# EAGLE design main (EAGLE 6.6.0)
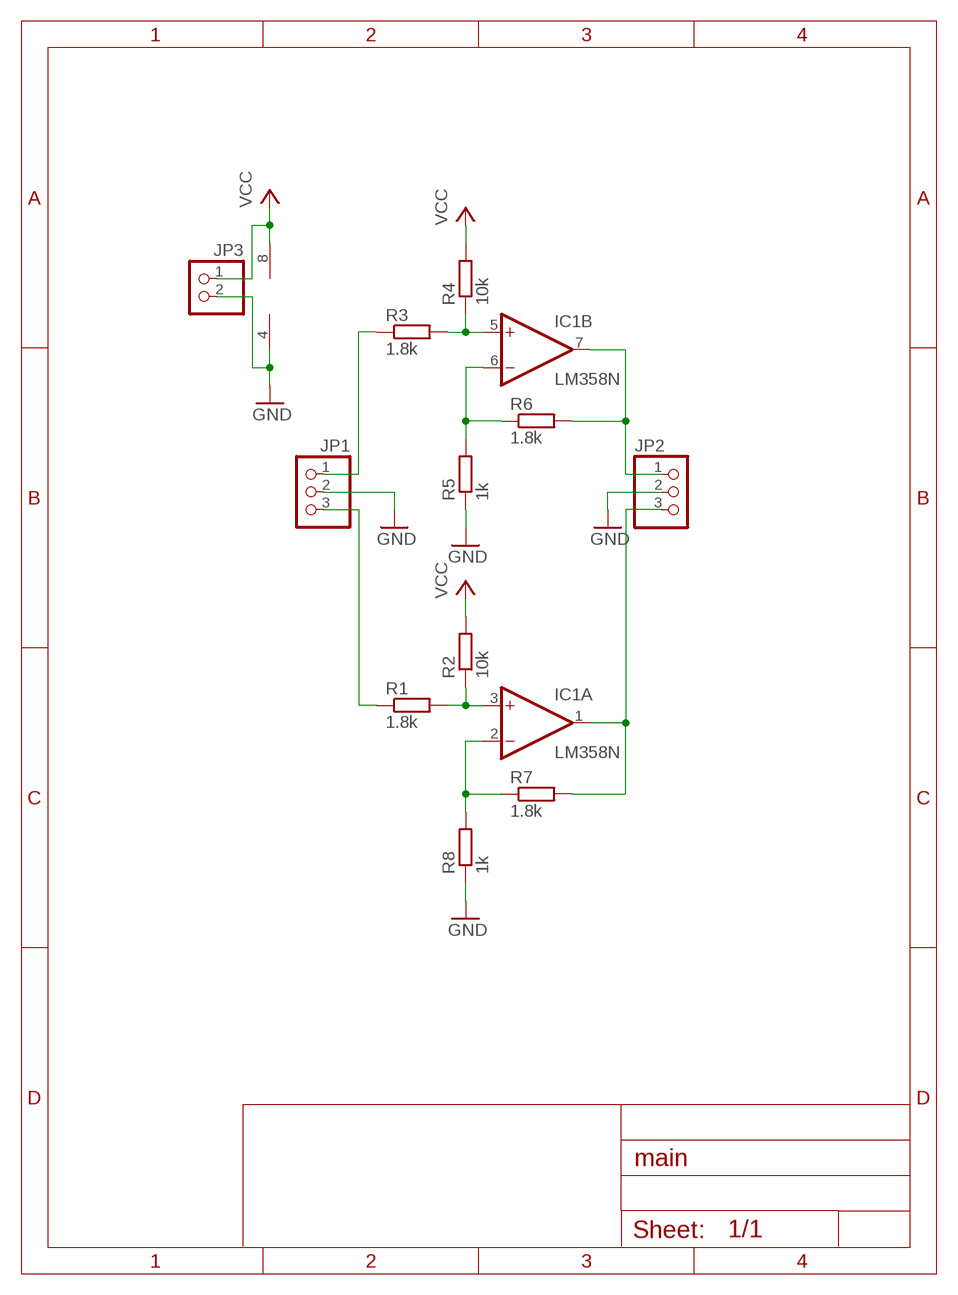
[diagram p0: schematic, sheet 1]

## Parts
IC1  LM358N  [DIL08]
JP1  PINHD-1X3  [1X03]
JP2  PINHD-1X3  [1X03]
JP3  PINHD-1X2  [1X02]
R1  1.8k  R-EU_0204/7  [0204/7]
R2  10k  R-EU_0204/7  [0204/7]
R3  1.8k  R-EU_0204/7  [0204/7]
R4  10k  R-EU_0204/7  [0204/7]
R5  1k  R-EU_0204/7  [0204/7]
R6  1.8k  R-EU_0204/7  [0204/7]
R7  1.8k  R-EU_0204/7  [0204/7]
R8  1k  R-EU_0204/7  [0204/7]

## Nets
GND: IC1.4(P:V-) JP1.2 JP2.2 JP3.2 R5.1 R8.1
N$1: IC1.5(B:+IN) R3.2 R4.1
N$2: IC1.3(A:+IN) R1.2 R2.1
N$3: IC1.6(B:-IN) R5.2 R6.1
N$4: IC1.7(B:OUT) JP2.1 R6.2
N$5: IC1.2(A:-IN) R7.1 R8.2
N$6: IC1.1(A:OUT) JP2.3 R7.2
N$8: JP1.1 R3.1
N$9: JP1.3 R1.1
VCC: IC1.8(P:V+) JP3.1 R2.2 R4.2

## Library data of the parts
IC1 = linear:LM358: OP AMP also LM158; LM258; LM2904 Source: http://cache.national.com/ds/LM/LM158.pdf
JP1 JP2 = pinhead:PINHD-1X3: PIN HEADER
JP3 = pinhead:PINHD-1X2: PIN HEADER
R1-R8 = rcl:R-EU_: RESISTOR, European symbol

## Board
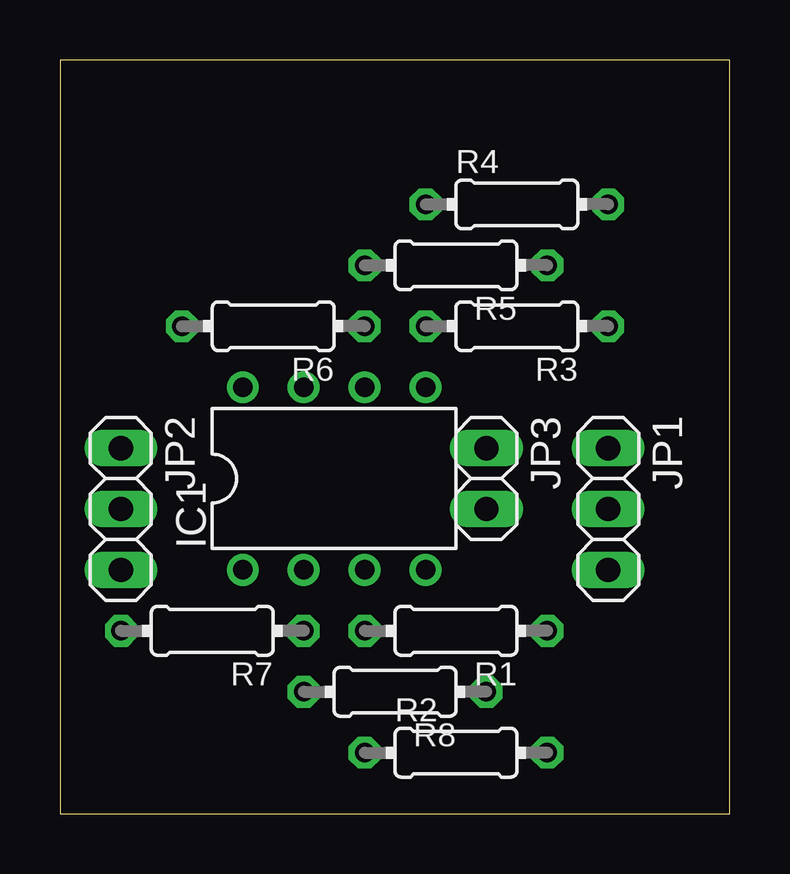
[diagram p1: board, top side]
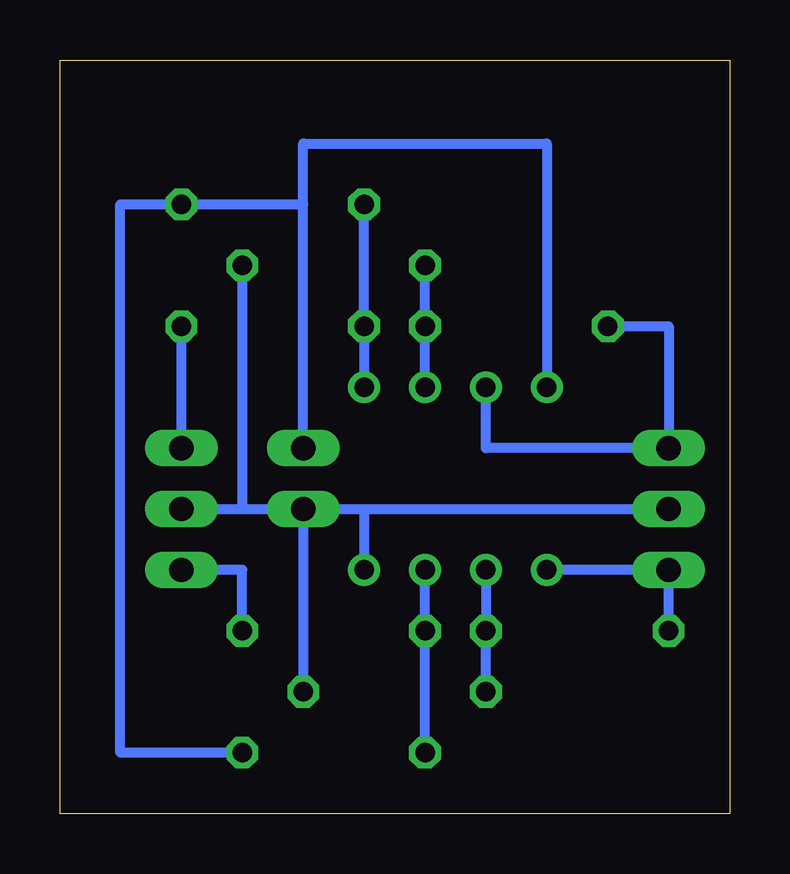
[diagram p2: board, bottom side, seen from below]

Size 27.92 x 31.42 mm. Coordinates in mm from the lower left corner, seen from the top.
Outline: 0,0 27.92,0 27.92,31.42 0,31.42 0,0
Copper layers (1*16): Top 0.035mm / dielectric 1.5mm / Bottom 0.035mm
Design rules "default": minimum track width 10mil, minimum drill 24mil, track to track 8mil, track to pad 8mil, pad to pad 8mil, via to via 8mil, smd to smd 8mil, copper to edge 40mil, drill to drill 8mil, minimum pad ring 10mil, minimum via ring 8mil, stop-mask expansion 4mil, vias tented up to drill 0mil, thermal gap 10mil

### Footprints (pad centres in the part's own frame; a part is rotated, then mirrored left to right if it is on the bottom)
DIL08 = drill 0.813 pad 1.27: 1 -3.81,-3.81; 2 -1.27,-3.81; 3 1.27,-3.81; 4 3.81,-3.81; 5 3.81,3.81; 6 1.27,3.81; 7 -1.27,3.81; 8 -3.81,3.81
1X03 = drill 1.016 long: 1 -2.54,0; 2 0,0; 3 2.54,0
1X02 = drill 1.016 long: 1 -1.27,0; 2 1.27,0
0204/7 = drill 0.813 octagon: 1 -3.81,0; 2 3.81,0

### Placement (x,y rotation side)
IC1  11.43,13.97 0 top
JP1  22.86,12.7 270 top
JP2  2.54,12.7 270 top
JP3  17.78,13.97 270 top
R1  16.51,7.62 180 top
R2  16.51,2.54 0 top
R3  19.05,20.32 180 top
R4  19.05,25.4 0 top
R5  16.51,22.86 180 top
R6  8.89,20.32 180 top
R7  6.35,7.62 180 top
R8  13.97,5.08 180 top

### Tracks (layer width: path | path; a pad name or v marks a point on that pad's centre or on a via)
GND
  Bottom 0.406: JP3.2 R8.1 | JP1.2 20.32,12.7 | 20.32,12.7 JP3.2 | R5.1 20.32,12.7 | 15.24,12.7 IC1.4 | JP3.2 15.24,12.7 | 15.24,12.7 JP2.2
N$1
  Bottom 0.406: IC1.5 R3.2 R4.1
N$2
  Bottom 0.406: IC1.3 R1.2 R2.1
N$3
  Bottom 0.406: IC1.6 R6.1 R5.2
N$4
  Bottom 0.406: R6.2 2.54,20.32 JP2.1 10.16,15.24 IC1.7
N$5
  Bottom 0.406: R8.2 R7.1 IC1.2
N$6
  Bottom 0.406: R7.2 JP2.3 IC1.1
N$8
  Bottom 0.406: R3.1 JP1.1
N$9
  Bottom 0.406: R1.1 20.32,10.16 JP1.3
VCC
  Bottom 0.406: JP3.1 17.78,25.4 | 17.78,25.4 R4.2 25.4,25.4 25.4,2.54 R2.2 | 17.78,25.4 17.78,27.94 7.62,27.94 IC1.8